# Altium project BaseStation.PrjPCB
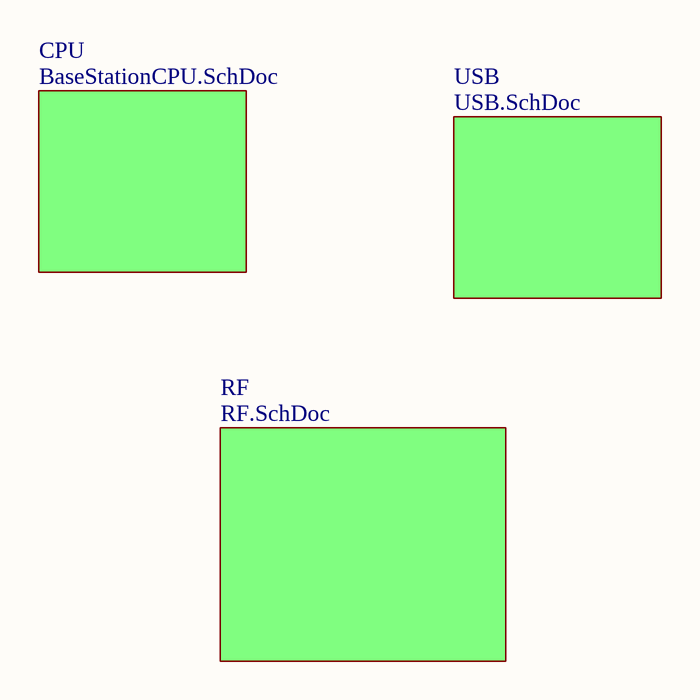
[diagram p0: BaseStation.SchDoc]
4 sheets, 48 parts. Net scope: flat (ports and power ports of the same name join across sheets).
Board file: BaseStation.PcbDoc
Sheets:
  BaseStation.SchDoc
    CPU = BaseStationCPU.SchDoc
    USB = USB.SchDoc
    RF = RF.SchDoc

## Sheet BaseStation.SchDoc
size A

### Sub-sheets
CPU = BaseStationCPU.SchDoc: no entries
RF = RF.SchDoc: no entries
USB = USB.SchDoc: no entries

## Sheet BaseStationCPU.SchDoc
size A4
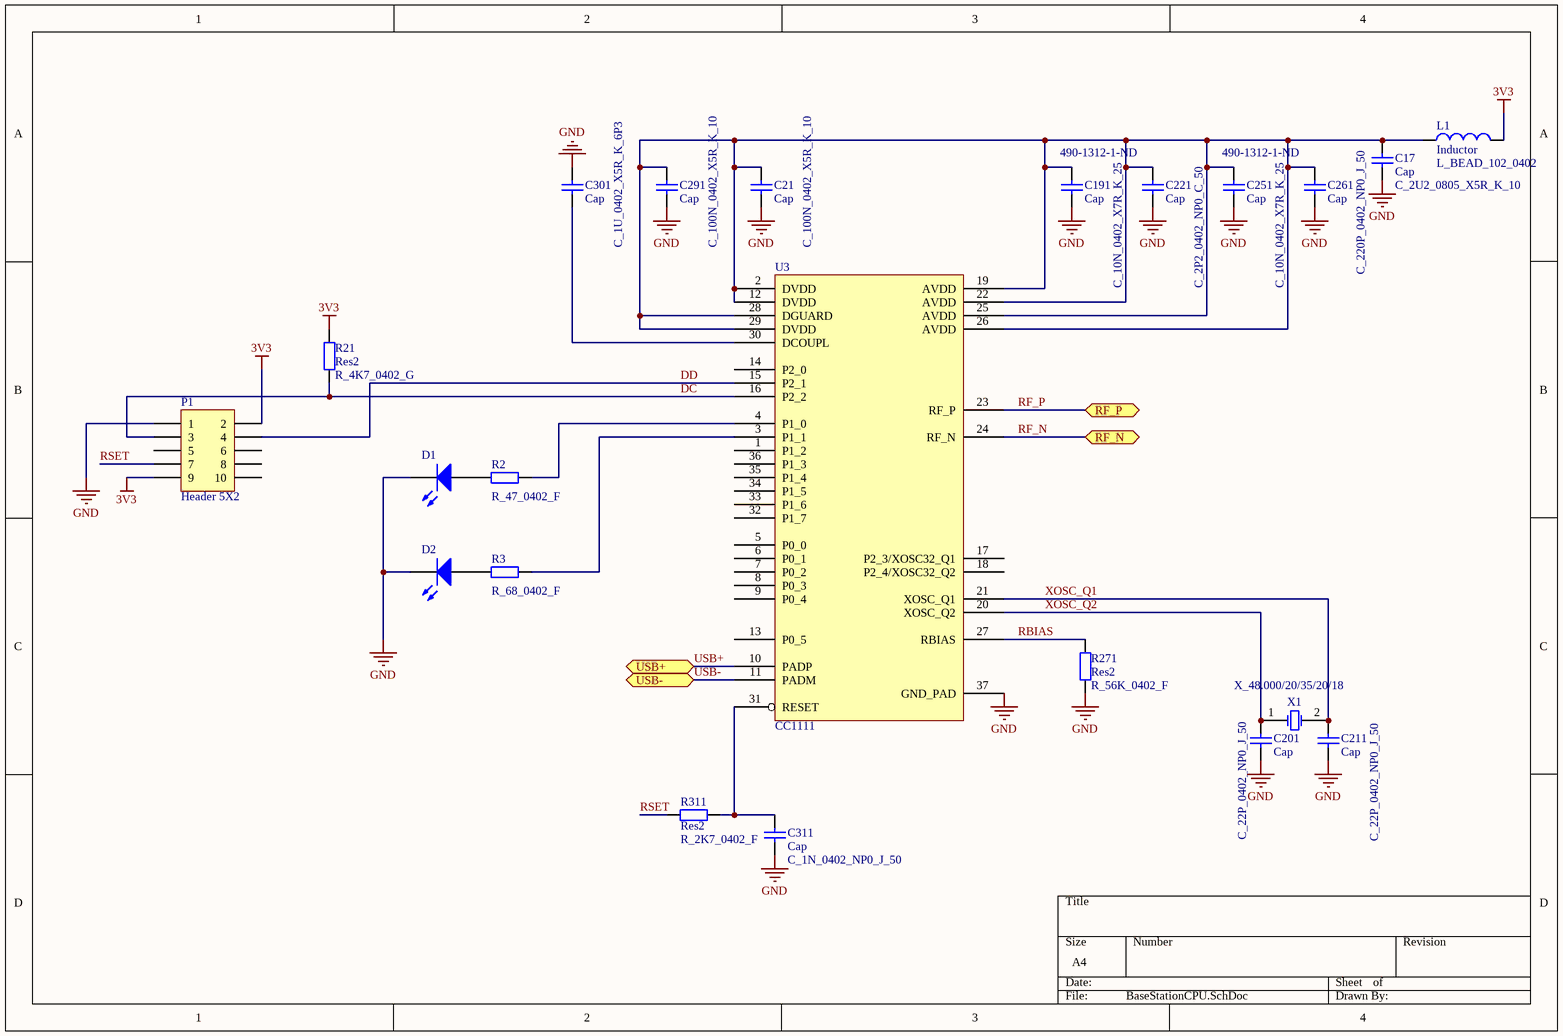
[diagram p1: BaseStationCPU.SchDoc]

### Parts
C17  Cap  value C_2U2_0805_X5R_K_10  [C_0805]
C21  Cap  value C_100N_0402_X5R_K_10  [C_0402]
C191  Cap  value C_10N_0402_X7R_K_25  Supplier Part Number 1: 490-1312-1-ND  [C_0402]
C201  Cap  value C_22P_0402_NP0_J_50  [C_0402]
C211  Cap  value C_22P_0402_NP0_J_50  [C_0402]
C221  Cap  value C_2P2_0402_NP0_C_50  [C_0402]
C251  Cap  value C_10N_0402_X7R_K_25  Supplier Part Number 1: 490-1312-1-ND  [C_0402]
C261  Cap  value C_220P_0402_NP0_J_50  [C_0402]
C291  Cap  value C_100N_0402_X5R_K_10  [C_0402]
C301  Cap  value C_1U_0402_X5R_K_6P3  [C_0402]
C311  Cap  value C_1N_0402_NP0_J_50  [C_0402]
D1  LED_EL19-21SYGC  [R_0603]  (value not drawn)
D2  LED_EL19-21SYGC  [R_0603]  (value not drawn)
L1  Inductor  value L_BEAD_102_0402  [R_0402]
P1  Header 5X2  [SMD HEADER]
R2  value R_47_0402_F  [R_0402]  (hidden comment: Res2)
R3  value R_68_0402_F  [R_0402]  (hidden comment: Res2)
R21  Res2  value R_4K7_0402_G  [R_0402]
R271  Res2  value R_56K_0402_F  [R_0402]
R311  Res2  value R_2K7_0402_F  [R_0402]
U3  CC1111  [TI_QFP36]
X1  X_48.000/20/35/20/18  [CX3225GB48000D0HEQZ1]

### Ports
RF_N, RF_P, USB+, USB-

### Nets
3V3: L1.2 P1.2 P1.9 R21.2
GND: C17.1 C21.1 C191.1 C201.1 C211.1 C221.1 C251.1 C261.1 C291.1 C301.2 C311.1 D1.2(K) D2.2(K) P1.1 R271.1 U3.37(GND_PAD)
DC: P1.3 R21.1 U3.16(P2_2)
DD: P1.4 U3.15(P2_1)
RBIAS: R271.2 U3.27(RBIAS)
RF_N: U3.24(RF_N) ; port RF_N
RF_P: U3.23(RF_P) ; port RF_P
RSET: P1.7 R311.1
USB+: U3.10(PADP) ; port USB+
USB-: U3.11(PADM) ; port USB-
XOSC_Q1: C211.2 U3.21(XOSC_Q1) X1.2(OSC2)
XOSC_Q2: C201.2 U3.20(XOSC_Q2) X1.1(OSC1)
NetC17_2: C17.2 C21.2 C191.2 C221.2 C251.2 C261.2 C291.2 L1.1 U3.2(DVDD) U3.12(DVDD) U3.19(AVDD) U3.22(AVDD) U3.25(AVDD) U3.26(AVDD) U3.28(DGUARD) U3.29(DVDD)
NetC301_1: C301.1 U3.30(DCOUPL)
NetC311_2: C311.2 R311.2 U3.31(RESET)
NetD1_1: D1.1(A) R2.1
NetD2_1: D2.1(A) R3.1
NetR2_2: R2.2 U3.4(P1_0)
NetR3_2: R3.2 U3.3(P1_1)

Not connected (* = marked no-connect by the designer): P1 5 6 8 10; U3 1(P1_2) 5(P0_0) 6(P0_1) 7(P0_2) 8(P0_3) 9(P0_4) 13(P0_5) 14(P2_0) 17(P2_3/XOSC32_Q1) 18(P2_4/XOSC32_Q2) 32(P1_7) 33(P1_6) 34(P1_5) 35(P1_4) 36(P1_3)

### Library data of the parts
C17 C21 C191 C201 C211 C221 C251 C261 C291 C301 C311 = Cap: Capacitor; Published: 8-Jun-2000; LatestRevisionDate: 17-Jul-2002; LatestRevisionNote: Re-released for DXP Platform.; Publisher: Altium Limited; Supplier 1: Digi-Key
  C17: Supplier Part Number 1: 445-3459-1-ND; Supplier 2: Mouser; Supplier Part Number 2: 81-GRM219R61A225KA1D
  C21 C291: Supplier Part Number 1: 490-1318-6-ND; Supplier 2: Mouser; Supplier Part Number 2: 81-GRM155R61A104KA01
  C201 C211: Supplier Part Number 1: 311-1018-6-ND
  C221: Supplier Part Number 1: 490-1267-1-ND; Supplier 2: Mouser; Supplier Part Number 2: 81-GRM36C2R2C50
  C261: Supplier Part Number 1: 490-1293-1-ND; Supplier 2: Mouser; Supplier Part Number 2: 81-GRM1555C1H221JA01
  C301: Supplier Part Number 1: 490-1320-1-ND; Supplier 2: Mouser; Supplier Part Number 2: 81-GRM155R60J105KE19
  C311: Supplier Part Number 1: 490-3244-1-ND; Supplier 2: Mouser; Supplier Part Number 2: 81-GRM1555C1H102JA1D
D1 = LED2: LED ALINGAP YW/GN CLEAR 0603 SMD; Published: 8-Jun-2000; LatestRevisionDate: 17-Jul-2002; LatestRevisionNote: Re-released for DXP Platform.; PackageVersion: Feb-2002; PackageReference: 3.2X1.6X1.1; Publisher: Altium Limited; PackageDescription: SM LED; 2 Flat Leads; Supplier 1: Digi-Key; Supplier Part Number 1: 598-8060-102F-ND; Supplier 2: Mouser; Supplier Part Number 2: 645-598-8060-107F
D2 = LED2: LED 660NM RED WTR CLR 0603 SMD; Published: 8-Jun-2000; LatestRevisionDate: 17-Jul-2002; LatestRevisionNote: Re-released for DXP Platform.; PackageVersion: Feb-2002; PackageReference: 3.2X1.6X1.1; Publisher: Altium Limited; PackageDescription: SM LED; 2 Flat Leads; Supplier 1: Digi-Key; Supplier Part Number 1: 511-1298-1-ND; Supplier 2: Digi-Key; Supplier Part Number 2: 511-1298-2-ND
L1 = Inductor: Code_IEC: 1005; Published: 8-Jun-2000; LatestRevisionDate: 29-May-2009; LatestRevisionNote: IPC-7351 Footprint Added.; PackageReference: 0402-A; Publisher: Altium Limited; PackageDescription: Chip Inductor; Code_JEITA: 0402; Supplier 1: Digi-Key; Supplier Part Number 1: 490-3999-1-ND; Supplier 2: Mouser; Supplier Part Number 2: 81-BLM15HG102SN1D
P1 = Header 5X2: Header, 5-Pin, Dual row; LatestRevisionDate: 17-Jul-2002; LatestRevisionNote: Re-released for DXP Platform.; Publisher: Altium Limited; Supplier 1: Digi-Key; Supplier Part Number 1: FTSH-105-01-L-DV-TR-ND
R2 R3 R21 R271 R311 = Res2: Resistor; Published: 8-Jun-2000; LatestRevisionDate: 17-Jul-2002; LatestRevisionNote: Re-released for DXP Platform.; Publisher: Altium Limited; Supplier 1: Digi-Key
  R2: Supplier Part Number 1: 311-47JRDKR-ND; Supplier 2: Newark; Supplier Part Number 2: 68R0013
  R3: Supplier Part Number 1: 311-68JRDKR-ND; Supplier 2: Farnell; Supplier Part Number 2: 9232621
  R21: PackageReference: AXIAL-0.4; PackageDescription: Axial Device, Thru-Hole; 2 Leads; 0.4 in Pin Spacing; Supplier Part Number 1: 311-4.7KJRCT-ND
  R271: Supplier Part Number 1: 541-56.0KLCT-ND; Supplier 2: Mouser; Supplier Part Number 2: 71-CRCW040256K0FKED
  R311: Supplier Part Number 1: 541-2.70KLCT-ND; Supplier 2: Mouser; Supplier Part Number 2: 71-CRCW0402-2.7K-E3
U3 = CC1111: RF Microcontrollers (MCU) True System-on-Chip; Manufacturer: Texas Instruments; Manufacturer Part Number: CC1110F32RSPR; Interface Type: 3-Wire SPI; Supply Voltage (Max): 3.6 V; Supply Voltage (Min): 2 V; Operating Supply Voltage: 2 V to 3.6 V; RoHS: RoHS Compliant; Category: RF Microcontrollers (MCU); Stock 1: 10995; Pricing 1: 1=5.75, 25=4.60, 100=3.68, 250=3.06, 500=2.99, 1000=2.95, 2000=2.90, 2500=2.90 (USD); Operating Temperature Range: - 40 C to + 85 C; Package / Case: QFN-36; Packaging: Reel; Mounting Style: SMD/SMT; Maximum Operating Temperature: + 85 C; Minimum Operating Temperature: - 40 C; Product Category: RF Integrated Circuits; Standard Pack Qty: 2500; RoHS - Mouser: Y; Minimum Order Quantity: 1; Reeling: True; ComponentLink1URL: http://www.ti.com/lit/ds/symlink/cc1110f32.pdf; ComponentLink1Description: http://www.ti.com/lit/ds/symlink/cc1110f32.pdf; Supplier 1: Digi-Key; Supplier Part Number 1: 296-22684-1-ND; Supplier 2: Digi-Key; Supplier Part Number 2: 296-22684-2-ND; Supplier 3: Digi-Key; Supplier Part Number 3: 296-22684-6-ND; Supplier 4: Digi-Key; Supplier Part Number 4: CC1111F32RSPRG3-ND
X1 = XTAL: Crystal Oscillator; Published: 8-Jun-2000; LatestRevisionDate: 17-Jul-2002; LatestRevisionNote: Re-released for DXP Platform.; PackageReference: R38; Publisher: Altium Limited; PackageDescription: Crystal, Thru-Hole; 2 Leads; Body 3.1 x 8.2 mm (Dia.xH); Supplier 1: Digi-Key; Supplier Part Number 1: 478-6629-6-ND; Supplier 2: Mouser; Supplier Part Number 2: 581-CX3225GB48000HE

## Sheet USB.SchDoc
size A
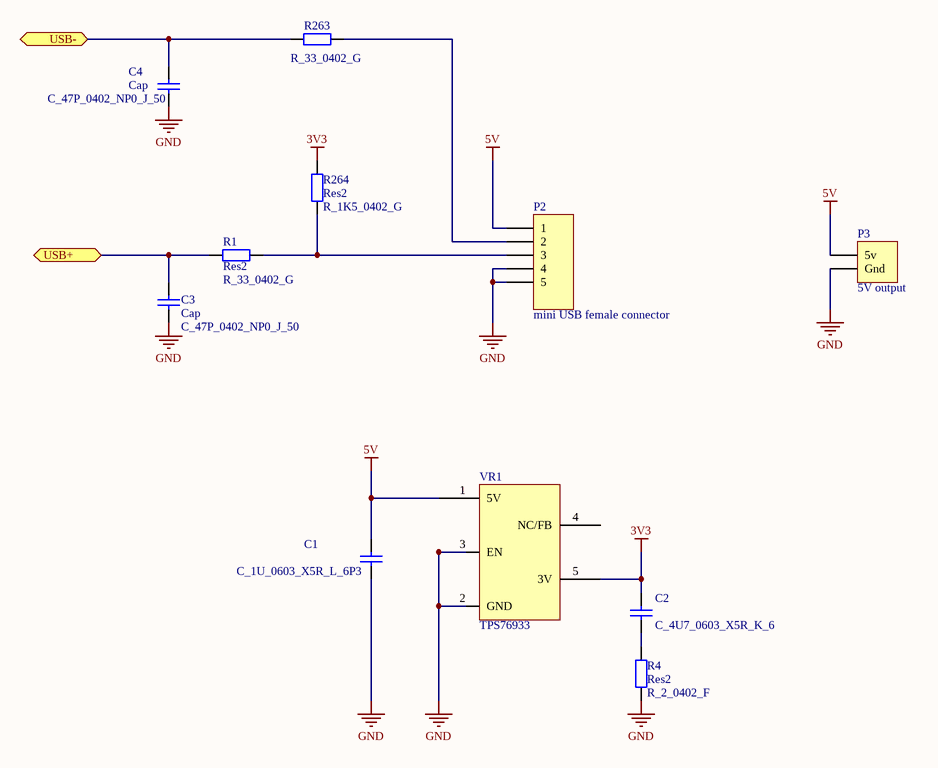
[diagram p2: USB.SchDoc]

### Parts
C1  value C_1U_0603_X5R_L_6P3  [C_0603]  (hidden comment: Cap)
C2  value C_4U7_0603_X5R_K_6  [C_0603]  (hidden comment: Cap)
C3  Cap  value C_47P_0402_NP0_J_50  [C_0402]
C4  Cap  value C_47P_0402_NP0_J_50  [C_0402]
P2  mini USB female connector  [MicroUSB10118193]
P3  5V output  [Charger Board Connector Female]
R1  Res2  value R_33_0402_G  [R_0402]
R4  Res2  value R_2_0402_F  [R_0402]
R263  value R_33_0402_G  [R_0402]  (hidden comment: Res2)
R264  Res2  value R_1K5_0402_G  [R_0402]
VR1  TPS76933  [TPS76933]

### Ports
USB+, USB-

### Nets
3V3: C2.1 R264.1 VR1.5(3V)
5V: C1.1 P2.1 P3.2(5v) VR1.1(5V)
GND: C1.2 C3.1 C4.1 P2.4 P2.5 P3.3(Gnd) R4.1 VR1.2(GND) VR1.3(EN)
USB+: C3.2 R1.1 ; port USB+
USB-: C4.2 R263.2 ; port USB-
NetC2_2: C2.2 R4.2
NetP2_2: P2.2 R263.1
NetP2_3: P2.3 R1.2 R264.2

Not connected (* = marked no-connect by the designer): VR1 4(NC/FB)

### Library data of the parts
C1-C4 = Cap: Capacitor; Published: 8-Jun-2000; LatestRevisionDate: 17-Jul-2002; LatestRevisionNote: Re-released for DXP Platform.; Publisher: Altium Limited; Supplier 1: Digi-Key
  C1: Supplier Part Number 1: 311-1372-6-ND; Supplier 2: Mouser; Supplier Part Number 2: 603-CC603ZRY5V7BB105
  C2: Supplier Part Number 1: 399-3482-6-ND
  C3 C4: Supplier Part Number 1: 311-1021-6-ND
P2 = Header 6: USB connector; LatestRevisionDate: 17-Jul-2002; LatestRevisionNote: Re-released for DXP Platform.; Publisher: Altium Limited; Supplier 1: Digi-Key; Supplier Part Number 1: 609-4616-1-ND
P3 = Header 2: 5V output to charge BrewBit; LatestRevisionDate: 17-Jul-2002; LatestRevisionNote: Re-released for DXP Platform.; Publisher: Altium Limited
R1 R4 R263 R264 = Res2: Resistor; Published: 8-Jun-2000; LatestRevisionDate: 17-Jul-2002; LatestRevisionNote: Re-released for DXP Platform.; PackageReference: AXIAL-0.4; Publisher: Altium Limited; PackageDescription: Axial Device, Thru-Hole; 2 Leads; 0.4 in Pin Spacing; Supplier 1: Digi-Key
  R1: Supplier Part Number 1: 311-33JRDKR-ND; Supplier 2: Newark; Supplier Part Number 2: 68R0002; Supplier 3: Mouser; Supplier Part Number 3: 603-RC0402JR-0733RL
  R4: Supplier Part Number 1: 311-2.0JRDKR-ND; Supplier 2: Mouser; Supplier Part Number 2: 603-RC0402JR-072RL
  R263: Supplier Part Number 1: 311-33JRDKR-ND
  R264: Supplier Part Number 1: 311-1.5KJRDKR-ND
VR1 = TPS76933: IC REG LDO 3.3V .1A SOT-23-5; Supplier 1: Digi-Key; Supplier Part Number 1: 296-11039-1-ND

## Sheet RF.SchDoc
size A
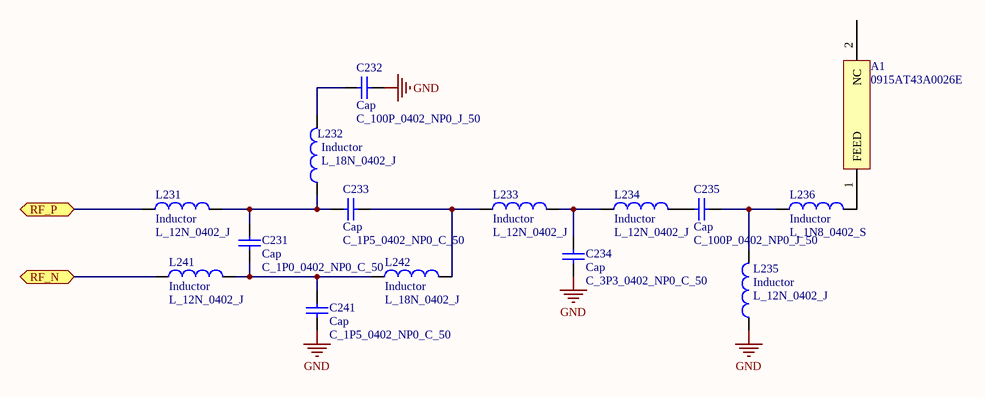
[diagram p3: RF.SchDoc]

### Parts
A1  0915AT43A0026E  [0915AT43A0026]
C231  Cap  value C_1P0_0402_NP0_C_50  [C_0402]
C232  Cap  value C_100P_0402_NP0_J_50  [C_0402]
C233  Cap  value C_1P5_0402_NP0_C_50  [C_0402]
C234  Cap  value C_3P3_0402_NP0_C_50  [C_0402]
C235  Cap  value C_100P_0402_NP0_J_50  [C_0402]
C241  Cap  value C_1P5_0402_NP0_C_50  [C_0402]
L231  Inductor  value L_12N_0402_J  [R_0402]
L232  Inductor  value L_18N_0402_J  [R_0402]
L233  Inductor  value L_12N_0402_J  [R_0402]
L234  Inductor  value L_12N_0402_J  [R_0402]
L235  Inductor  value L_12N_0402_J  [R_0402]
L236  Inductor  value L_1N8_0402_S  [R_0402]
L241  Inductor  value L_12N_0402_J
L242  Inductor  value L_18N_0402_J  [R_0402]

### Ports
RF_N, RF_P

### Nets
GND: C232.2 C234.1 C241.1 L235.1
RF_N: L241.1 ; port RF_N
RF_P: L231.1 ; port RF_P
NetA1_1: A1.1(FEED) L236.2
NetC231_1: C231.1 C241.2 L241.2 L242.1
NetC231_2: C231.2 C233.1 L231.2 L232.1
NetC232_1: C232.1 L232.2
NetC233_2: C233.2 L233.1 L242.2
NetC234_2: C234.2 L233.2 L234.1
NetC235_1: C235.1 L234.2
NetC235_2: C235.2 L235.2 L236.1

Not connected (* = marked no-connect by the designer): A1 2(NC)

### Library data of the parts
A1 = 0915AT43A0026E: RF CHIP ANTENNA 902 - 928MHZ; Manufacturer: Johanson Technology Inc; Number of Bands: 1; Frequency: 902MHz ~ 928MHz; Gain: -1dBi; Supplier 1: Digi-Key; Manufacturer Part Number: 0915AT43A0026E; RoHS: RoHS Compliant; Category: RF/IF and RFID; Stock 1: 832; Pricing 1: 1=1.22, 10=1.022, 25=0.8808, 50=0.8266, 100=0.6525, 250=0.54376, 500=0.48938 (USD); Antenna Type: Chip; VSWR: -; Termination: Surface Mount; Mounting Type: Surface Mount; Height (Max): -; Packaging: Cut Tape (CT); Supplier Part Number 1: 712-1535-1-ND
C231-C235 C241 = Cap: Capacitor; Published: 8-Jun-2000; LatestRevisionDate: 17-Jul-2002; LatestRevisionNote: Re-released for DXP Platform.; Publisher: Altium Limited; Supplier 1: Digi-Key
  C231: Supplier Part Number 1: 490-3199-1-ND; Supplier 2: Mouser; Supplier Part Number 2: 81-GRM1555C1H1R0CZ01
  C232 C235: Supplier Part Number 1: 490-3458-1-ND
  C233 C241: Supplier Part Number 1: 490-1266-1-ND; Supplier 2: Mouser; Supplier Part Number 2: 81-GRM36C1R5C50
  C234: Supplier Part Number 1: 490-1270-1-ND; Supplier 2: Mouser; Supplier Part Number 2: 81-GRM36C3R3C50
L231-L236 L241 L242 = Inductor: Code_IEC: 1005; Published: 8-Jun-2000; LatestRevisionDate: 29-May-2009; LatestRevisionNote: IPC-7351 Footprint Added.; PackageReference: 0402-A; Publisher: Altium Limited; PackageDescription: Chip Inductor; Code_JEITA: 0402; Supplier 1: Digi-Key; Supplier 2: Mouser
  L231 L233-L235 L241: Supplier Part Number 1: 490-2624-1-ND; Supplier Part Number 2: 81-LQG15HS12NJ02D
  L232 L242: Supplier Part Number 1: 490-2626-1-ND; Supplier Part Number 2: 81-LQG15HS18NJ02D
  L236: Supplier Part Number 1: 490-1127-1-ND; Supplier Part Number 2: 81-LQP15MN1N8B02D

## Nets that join several sheets
3V3: BaseStationCPU (L1.2 P1.2 P1.9 R21.2), USB (C2.1 R264.1 VR1.5)
GND: BaseStationCPU (16 pins), USB (9 pins), RF (C232.2 C234.1 C241.1 L235.1)
RF_N: BaseStationCPU (U3.24), RF (L241.1)
RF_P: BaseStationCPU (U3.23), RF (L231.1)
USB+: BaseStationCPU (U3.10), USB (C3.2 R1.1)
USB-: BaseStationCPU (U3.11), USB (C4.2 R263.2)